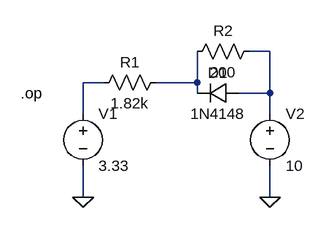
[diagram p0: schematic Draft2.asc]
Draft2.asc, the LTspice schematic file:
Version 4
SHEET 1 880 680
WIRE 384 32 352 32
WIRE 128 80 96 80
WIRE 256 80 208 80
WIRE 272 80 272 32
WIRE 272 80 256 80
WIRE 272 96 272 80
WIRE 384 96 384 32
WIRE 384 96 336 96
WIRE 96 128 96 80
WIRE 384 128 384 96
WIRE 96 256 96 208
WIRE 384 256 384 208
FLAG 96 256 0
FLAG 384 256 0
DATAFLAG 384 96 ""
DATAFLAG 256 80 ""
SYMBOL voltage 96 112 R0
WINDOW 123 0 0 Left 2
WINDOW 39 0 0 Left 2
SYMATTR InstName V1
SYMATTR Value 3.33
SYMBOL voltage 384 112 R0
WINDOW 123 0 0 Left 2
WINDOW 39 0 0 Left 2
SYMATTR InstName V2
SYMATTR Value 10
SYMBOL res 224 64 R90
WINDOW 0 0 56 VBottom 2
WINDOW 3 32 56 VTop 2
SYMATTR InstName R1
SYMATTR Value 1.82k
SYMBOL res 368 16 R90
WINDOW 0 0 56 VBottom 2
WINDOW 3 32 56 VTop 2
SYMATTR InstName R2
SYMATTR Value 200
SYMBOL diode 336 80 R90
WINDOW 0 0 32 VBottom 2
WINDOW 3 32 32 VTop 2
SYMATTR InstName D1
SYMATTR Value 1N4148
TEXT 0 96 Left 2 !.op

The netlist it stands for:
* Draft2.asc
V1 N002 0 3.33
V2 N001 0 10
R1 N003 N002 1.82k
R2 N001 N003 200
D1 N001 N003 1N4148
.model D D
.lib standard.dio
.op
.backanno
.end